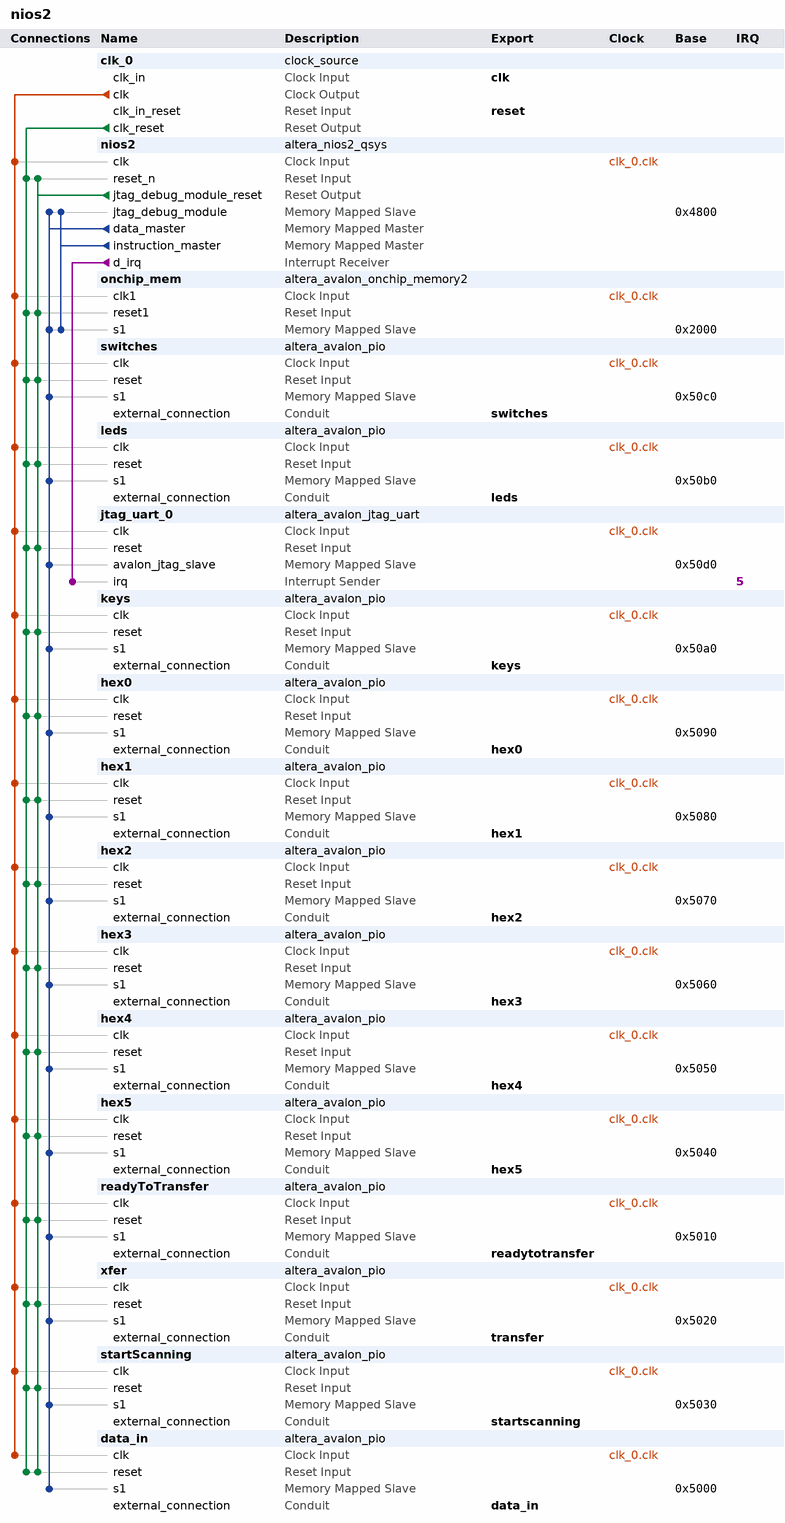
[diagram p0: system contents]
# Platform Designer (Qsys) system nios2, Cyclone V 5CSEMA5F31C6
# Parameters at their usual value, and those the tool derives, are not listed.
package require -exact qsys 16.0
create_system nios2
set_project_property DEVICE_FAMILY {Cyclone V}
set_project_property DEVICE 5CSEMA5F31C6

add_instance clk_0 clock_source 16.0
set_instance_parameter_value clk_0 clockFrequency 50000000

add_instance nios2 altera_nios2_qsys 16.0
set_instance_parameter_value nios2 breakSlave nios2.jtag_debug_module
set_instance_parameter_value nios2 exceptionSlave onchip_mem.s1
set_instance_parameter_value nios2 icache_size 4096
set_instance_parameter_value nios2 impl Tiny
set_instance_parameter_value nios2 mmu_TLBMissExcSlave None
set_instance_parameter_value nios2 resetSlave onchip_mem.s1
set_instance_parameter_value nios2 resetrequest_enabled true

add_instance onchip_mem altera_avalon_onchip_memory2 16.0
set_instance_parameter_value onchip_mem dataWidth 32
set_instance_parameter_value onchip_mem dualPort false
set_instance_parameter_value onchip_mem initMemContent true
set_instance_parameter_value onchip_mem initializationFileName onchip_mem.hex
set_instance_parameter_value onchip_mem memorySize 8192

add_instance switches altera_avalon_pio 16.0
set_instance_parameter_value switches direction Input
set_instance_parameter_value switches width 8

add_instance leds altera_avalon_pio 16.0
set_instance_parameter_value leds direction Output
set_instance_parameter_value leds width 8

add_instance jtag_uart_0 altera_avalon_jtag_uart 16.0
set_instance_parameter_value jtag_uart_0 simInteractiveOptions NO_INTERACTIVE_WINDOWS

add_instance keys altera_avalon_pio 16.0
set_instance_parameter_value keys direction Input
set_instance_parameter_value keys width 4

add_instance hex0 altera_avalon_pio 16.0
set_instance_parameter_value hex0 direction Output
set_instance_parameter_value hex0 width 7

add_instance hex1 altera_avalon_pio 16.0
set_instance_parameter_value hex1 direction Output
set_instance_parameter_value hex1 width 7

add_instance hex2 altera_avalon_pio 16.0
set_instance_parameter_value hex2 direction Output
set_instance_parameter_value hex2 width 7

add_instance hex3 altera_avalon_pio 16.0
set_instance_parameter_value hex3 direction Output
set_instance_parameter_value hex3 width 7

add_instance hex4 altera_avalon_pio 16.0
set_instance_parameter_value hex4 direction Output
set_instance_parameter_value hex4 width 7

add_instance hex5 altera_avalon_pio 16.0
set_instance_parameter_value hex5 direction Output
set_instance_parameter_value hex5 width 7

add_instance readyToTransfer altera_avalon_pio 16.0
set_instance_parameter_value readyToTransfer direction Input
set_instance_parameter_value readyToTransfer width 1

add_instance xfer altera_avalon_pio 16.0
set_instance_parameter_value xfer direction Output
set_instance_parameter_value xfer width 1

add_instance startScanning altera_avalon_pio 16.0
set_instance_parameter_value startScanning direction Output
set_instance_parameter_value startScanning width 1

add_instance data_in altera_avalon_pio 16.0
set_instance_parameter_value data_in direction Input
set_instance_parameter_value data_in width 8

# connections
add_connection clk_0.clk data_in.clk clock
add_connection clk_0.clk hex0.clk clock
add_connection clk_0.clk hex1.clk clock
add_connection clk_0.clk hex2.clk clock
add_connection clk_0.clk hex3.clk clock
add_connection clk_0.clk hex4.clk clock
add_connection clk_0.clk hex5.clk clock
add_connection clk_0.clk jtag_uart_0.clk clock
add_connection clk_0.clk keys.clk clock
add_connection clk_0.clk leds.clk clock
add_connection clk_0.clk nios2.clk clock
add_connection clk_0.clk onchip_mem.clk1 clock
add_connection clk_0.clk readyToTransfer.clk clock
add_connection clk_0.clk startScanning.clk clock
add_connection clk_0.clk switches.clk clock
add_connection clk_0.clk xfer.clk clock
add_connection clk_0.clk_reset data_in.reset reset
add_connection clk_0.clk_reset hex0.reset reset
add_connection clk_0.clk_reset hex1.reset reset
add_connection clk_0.clk_reset hex2.reset reset
add_connection clk_0.clk_reset hex3.reset reset
add_connection clk_0.clk_reset hex4.reset reset
add_connection clk_0.clk_reset hex5.reset reset
add_connection clk_0.clk_reset jtag_uart_0.reset reset
add_connection clk_0.clk_reset keys.reset reset
add_connection clk_0.clk_reset leds.reset reset
add_connection clk_0.clk_reset nios2.reset_n reset
add_connection clk_0.clk_reset onchip_mem.reset1 reset
add_connection clk_0.clk_reset readyToTransfer.reset reset
add_connection clk_0.clk_reset startScanning.reset reset
add_connection clk_0.clk_reset switches.reset reset
add_connection clk_0.clk_reset xfer.reset reset
add_connection nios2.jtag_debug_module_reset data_in.reset reset
add_connection nios2.jtag_debug_module_reset hex0.reset reset
add_connection nios2.jtag_debug_module_reset hex1.reset reset
add_connection nios2.jtag_debug_module_reset hex2.reset reset
add_connection nios2.jtag_debug_module_reset hex3.reset reset
add_connection nios2.jtag_debug_module_reset hex4.reset reset
add_connection nios2.jtag_debug_module_reset hex5.reset reset
add_connection nios2.jtag_debug_module_reset jtag_uart_0.reset reset
add_connection nios2.jtag_debug_module_reset keys.reset reset
add_connection nios2.jtag_debug_module_reset leds.reset reset
add_connection nios2.jtag_debug_module_reset nios2.reset_n reset
add_connection nios2.jtag_debug_module_reset onchip_mem.reset1 reset
add_connection nios2.jtag_debug_module_reset readyToTransfer.reset reset
add_connection nios2.jtag_debug_module_reset startScanning.reset reset
add_connection nios2.jtag_debug_module_reset switches.reset reset
add_connection nios2.jtag_debug_module_reset xfer.reset reset
add_connection nios2.data_master data_in.s1 avalon
set_connection_parameter_value nios2.data_master/data_in.s1 baseAddress 0x5000
add_connection nios2.data_master hex0.s1 avalon
set_connection_parameter_value nios2.data_master/hex0.s1 baseAddress 0x5090
add_connection nios2.data_master hex1.s1 avalon
set_connection_parameter_value nios2.data_master/hex1.s1 baseAddress 0x5080
add_connection nios2.data_master hex2.s1 avalon
set_connection_parameter_value nios2.data_master/hex2.s1 baseAddress 0x5070
add_connection nios2.data_master hex3.s1 avalon
set_connection_parameter_value nios2.data_master/hex3.s1 baseAddress 0x5060
add_connection nios2.data_master hex4.s1 avalon
set_connection_parameter_value nios2.data_master/hex4.s1 baseAddress 0x5050
add_connection nios2.data_master hex5.s1 avalon
set_connection_parameter_value nios2.data_master/hex5.s1 baseAddress 0x5040
add_connection nios2.data_master jtag_uart_0.avalon_jtag_slave avalon
set_connection_parameter_value nios2.data_master/jtag_uart_0.avalon_jtag_slave baseAddress 0x50d0
add_connection nios2.data_master keys.s1 avalon
set_connection_parameter_value nios2.data_master/keys.s1 baseAddress 0x50a0
add_connection nios2.data_master leds.s1 avalon
set_connection_parameter_value nios2.data_master/leds.s1 baseAddress 0x50b0
add_connection nios2.data_master nios2.jtag_debug_module avalon
set_connection_parameter_value nios2.data_master/nios2.jtag_debug_module baseAddress 0x4800
add_connection nios2.data_master onchip_mem.s1 avalon
set_connection_parameter_value nios2.data_master/onchip_mem.s1 baseAddress 0x2000
add_connection nios2.data_master readyToTransfer.s1 avalon
set_connection_parameter_value nios2.data_master/readyToTransfer.s1 baseAddress 0x5010
add_connection nios2.data_master startScanning.s1 avalon
set_connection_parameter_value nios2.data_master/startScanning.s1 baseAddress 0x5030
add_connection nios2.data_master switches.s1 avalon
set_connection_parameter_value nios2.data_master/switches.s1 baseAddress 0x50c0
add_connection nios2.data_master xfer.s1 avalon
set_connection_parameter_value nios2.data_master/xfer.s1 baseAddress 0x5020
add_connection nios2.instruction_master nios2.jtag_debug_module avalon
set_connection_parameter_value nios2.instruction_master/nios2.jtag_debug_module baseAddress 0x4800
add_connection nios2.instruction_master onchip_mem.s1 avalon
set_connection_parameter_value nios2.instruction_master/onchip_mem.s1 baseAddress 0x2000
add_connection nios2.d_irq jtag_uart_0.irq interrupt
set_connection_parameter_value nios2.d_irq/jtag_uart_0.irq irqNumber 5

# exported interfaces
add_interface clk clock sink
set_interface_property clk EXPORT_OF clk_0.clk_in
add_interface data_in conduit end
set_interface_property data_in EXPORT_OF data_in.external_connection
add_interface hex0 conduit end
set_interface_property hex0 EXPORT_OF hex0.external_connection
add_interface hex1 conduit end
set_interface_property hex1 EXPORT_OF hex1.external_connection
add_interface hex2 conduit end
set_interface_property hex2 EXPORT_OF hex2.external_connection
add_interface hex3 conduit end
set_interface_property hex3 EXPORT_OF hex3.external_connection
add_interface hex4 conduit end
set_interface_property hex4 EXPORT_OF hex4.external_connection
add_interface hex5 conduit end
set_interface_property hex5 EXPORT_OF hex5.external_connection
add_interface keys conduit end
set_interface_property keys EXPORT_OF keys.external_connection
add_interface leds conduit end
set_interface_property leds EXPORT_OF leds.external_connection
add_interface readytotransfer conduit end
set_interface_property readytotransfer EXPORT_OF readyToTransfer.external_connection
add_interface reset reset sink
set_interface_property reset EXPORT_OF clk_0.clk_in_reset
add_interface startscanning conduit end
set_interface_property startscanning EXPORT_OF startScanning.external_connection
add_interface switches conduit end
set_interface_property switches EXPORT_OF switches.external_connection
add_interface transfer conduit end
set_interface_property transfer EXPORT_OF xfer.external_connection

set_interconnect_requirement {$system} qsys_mm.clockCrossingAdapter HANDSHAKE
set_interconnect_requirement {$system} qsys_mm.enableEccProtection FALSE
set_interconnect_requirement {$system} qsys_mm.insertDefaultSlave FALSE
set_interconnect_requirement {$system} qsys_mm.maxAdditionalLatency 1

save_system nios2.qsys
